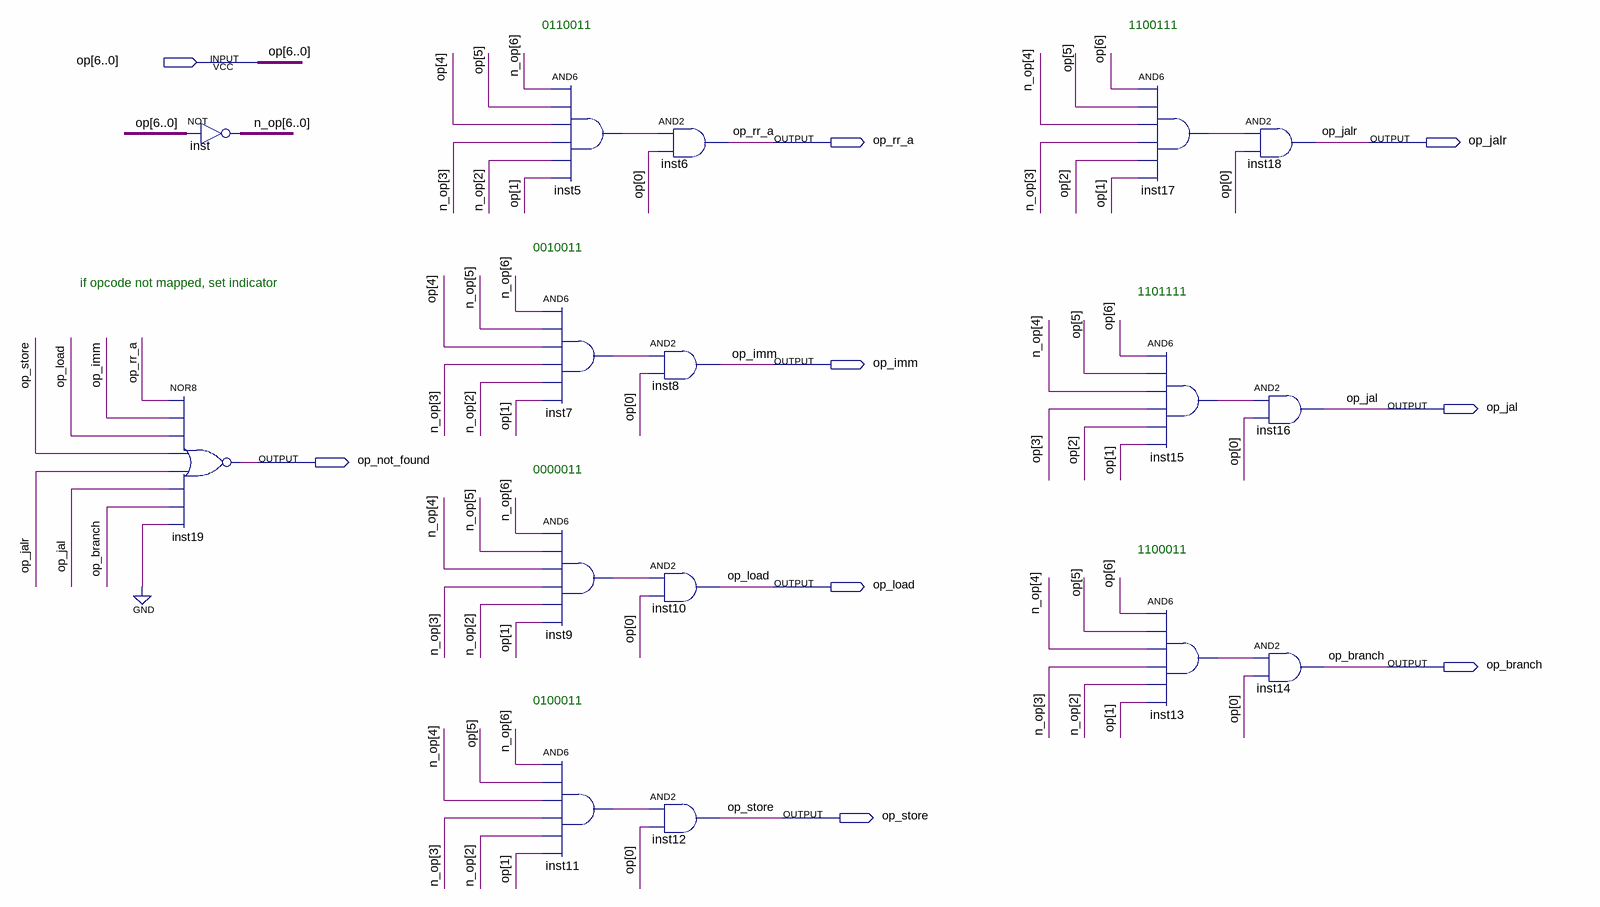
[diagram p0: schematic sheet]
// Quartus schematic opcode_decoder.bdf as structural Verilog: 16 symbols, 9 pins
module opcode_decoder (
  input  [6:0] op,
  output op_rr_a,
  output op_jalr,
  output op_imm,
  output op_jal,
  output op_not_found,
  output op_load,
  output op_branch,
  output op_store
);

  wire inst5_out, inst7_out, inst9_out, inst11_out, inst13_out, inst15_out, inst17_out;
  wire [6:0] n_op;

  assign n_op = ~op;  // NOT inst, 7 bits wide
  nor inst19 (op_not_found, op_rr_a, op_imm, op_load, op_store, op_jalr, op_jal, op_branch, 1'b0);
  and inst5 (inst5_out, n_op[6], op[5], op[4], n_op[3], n_op[2], op[1]);
  and inst7 (inst7_out, n_op[6], n_op[5], op[4], n_op[3], n_op[2], op[1]);
  and inst9 (inst9_out, n_op[6], n_op[5], n_op[4], n_op[3], n_op[2], op[1]);
  and inst11 (inst11_out, n_op[6], op[5], n_op[4], n_op[3], n_op[2], op[1]);
  and inst8 (op_imm, inst7_out, op[0]);
  and inst10 (op_load, inst9_out, op[0]);
  and inst12 (op_store, inst11_out, op[0]);
  and inst6 (op_rr_a, inst5_out, op[0]);
  and inst17 (inst17_out, op[6], op[5], n_op[4], n_op[3], op[2], op[1]);
  and inst15 (inst15_out, op[6], op[5], n_op[4], op[3], op[2], op[1]);
  and inst13 (inst13_out, op[6], op[5], n_op[4], n_op[3], n_op[2], op[1]);
  and inst18 (op_jalr, inst17_out, op[0]);
  and inst16 (op_jal, inst15_out, op[0]);
  and inst14 (op_branch, inst13_out, op[0]);

  // Notes on the sheet:
  //   0110011
  //   1100111
  //   0010011
  //   if opcode not mapped, set indicator
  //   1101111
  //   0000011
  //   1100011
  //   0100011
endmodule
